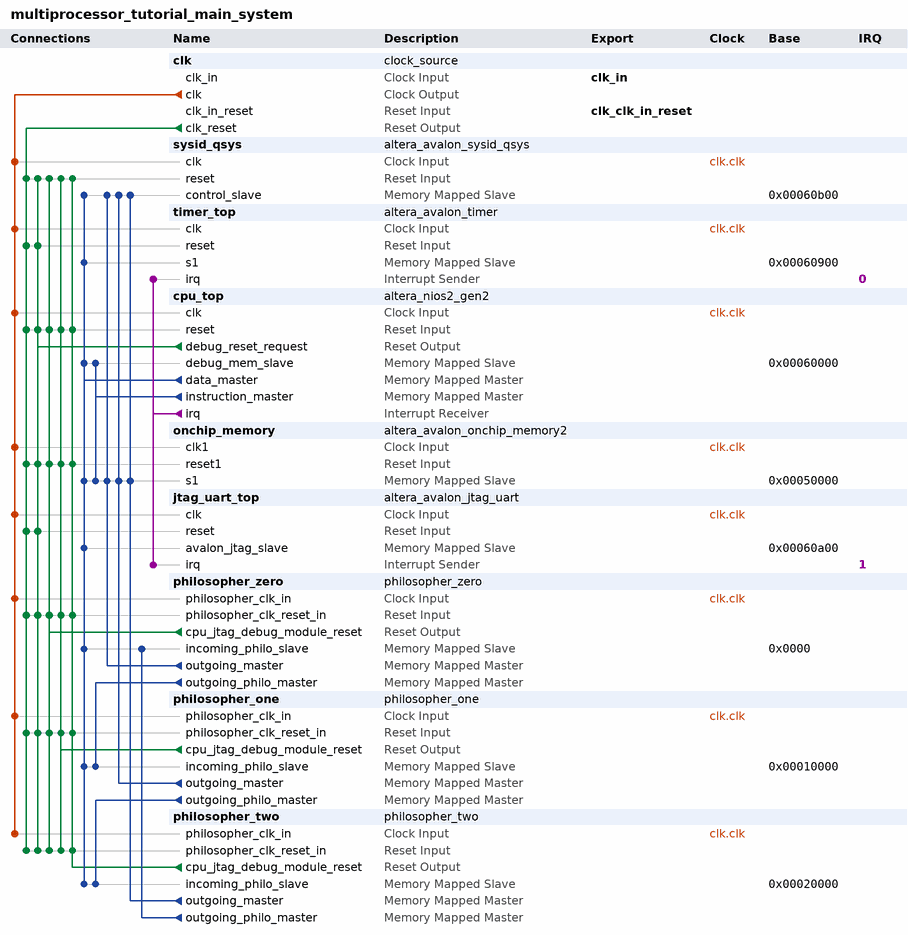
[diagram p0: system contents]
# Platform Designer (Qsys) system multiprocessor_tutorial_main_system, MAX 10 10M50DAF484C6GES
# Parameters at their usual value, and those the tool derives, are not listed.
package require -exact qsys 20.1
create_system multiprocessor_tutorial_main_system
set_project_property DEVICE_FAMILY {MAX 10}
set_project_property DEVICE 10M50DAF484C6GES

add_instance clk clock_source 20.1
set_instance_parameter_value clk clockFrequency 50000000

add_instance sysid_qsys altera_avalon_sysid_qsys 20.1
set_instance_parameter_value sysid_qsys id 0

add_instance timer_top altera_avalon_timer 20.1
set_instance_parameter_value timer_top period 10
set_instance_parameter_value timer_top periodUnits MSEC

add_instance cpu_top altera_nios2_gen2 20.1
set_instance_parameter_value cpu_top cpuID 5
set_instance_parameter_value cpu_top dcache_size 32768
set_instance_parameter_value cpu_top exceptionOffset 24608
set_instance_parameter_value cpu_top exceptionSlave onchip_memory.s1
set_instance_parameter_value cpu_top icache_size 32768
set_instance_parameter_value cpu_top impl Tiny
set_instance_parameter_value cpu_top mmu_autoAssignTlbPtrSz false
set_instance_parameter_value cpu_top resetOffset 24576
set_instance_parameter_value cpu_top resetSlave onchip_memory.s1
set_instance_parameter_value cpu_top setting_activateTrace true

add_instance onchip_memory altera_avalon_onchip_memory2 20.1
set_instance_parameter_value onchip_memory dataWidth 32
set_instance_parameter_value onchip_memory dualPort false
set_instance_parameter_value onchip_memory initMemContent true
set_instance_parameter_value onchip_memory initializationFileName onchip_memory
set_instance_parameter_value onchip_memory memorySize 32769

add_instance jtag_uart_top altera_avalon_jtag_uart 20.1
set_instance_parameter_value jtag_uart_top simInteractiveOptions INTERACTIVE_ASCII_OUTPUT

add_instance philosopher_zero philosopher_zero 1.0

add_instance philosopher_one philosopher_one 1.0

add_instance philosopher_two philosopher_two 1.0

# connections
add_connection clk.clk cpu_top.clk clock
add_connection clk.clk jtag_uart_top.clk clock
add_connection clk.clk onchip_memory.clk1 clock
add_connection clk.clk philosopher_one.philosopher_clk_in clock
add_connection clk.clk philosopher_two.philosopher_clk_in clock
add_connection clk.clk philosopher_zero.philosopher_clk_in clock
add_connection clk.clk sysid_qsys.clk clock
add_connection clk.clk timer_top.clk clock
add_connection clk.clk_reset cpu_top.reset reset
add_connection clk.clk_reset jtag_uart_top.reset reset
add_connection clk.clk_reset onchip_memory.reset1 reset
add_connection clk.clk_reset philosopher_one.philosopher_clk_reset_in reset
add_connection clk.clk_reset philosopher_two.philosopher_clk_reset_in reset
add_connection clk.clk_reset philosopher_zero.philosopher_clk_reset_in reset
add_connection clk.clk_reset sysid_qsys.reset reset
add_connection clk.clk_reset timer_top.reset reset
add_connection cpu_top.debug_reset_request cpu_top.reset reset
add_connection cpu_top.debug_reset_request jtag_uart_top.reset reset
add_connection cpu_top.debug_reset_request onchip_memory.reset1 reset
add_connection cpu_top.debug_reset_request philosopher_one.philosopher_clk_reset_in reset
add_connection cpu_top.debug_reset_request philosopher_two.philosopher_clk_reset_in reset
add_connection cpu_top.debug_reset_request philosopher_zero.philosopher_clk_reset_in reset
add_connection cpu_top.debug_reset_request sysid_qsys.reset reset
add_connection cpu_top.debug_reset_request timer_top.reset reset
add_connection philosopher_one.cpu_jtag_debug_module_reset cpu_top.reset reset
add_connection philosopher_one.cpu_jtag_debug_module_reset onchip_memory.reset1 reset
add_connection philosopher_one.cpu_jtag_debug_module_reset philosopher_one.philosopher_clk_reset_in reset
add_connection philosopher_one.cpu_jtag_debug_module_reset philosopher_two.philosopher_clk_reset_in reset
add_connection philosopher_one.cpu_jtag_debug_module_reset philosopher_zero.philosopher_clk_reset_in reset
add_connection philosopher_one.cpu_jtag_debug_module_reset sysid_qsys.reset reset
add_connection philosopher_two.cpu_jtag_debug_module_reset cpu_top.reset reset
add_connection philosopher_two.cpu_jtag_debug_module_reset onchip_memory.reset1 reset
add_connection philosopher_two.cpu_jtag_debug_module_reset philosopher_one.philosopher_clk_reset_in reset
add_connection philosopher_two.cpu_jtag_debug_module_reset philosopher_two.philosopher_clk_reset_in reset
add_connection philosopher_two.cpu_jtag_debug_module_reset philosopher_zero.philosopher_clk_reset_in reset
add_connection philosopher_two.cpu_jtag_debug_module_reset sysid_qsys.reset reset
add_connection philosopher_zero.cpu_jtag_debug_module_reset cpu_top.reset reset
add_connection philosopher_zero.cpu_jtag_debug_module_reset onchip_memory.reset1 reset
add_connection philosopher_zero.cpu_jtag_debug_module_reset philosopher_one.philosopher_clk_reset_in reset
add_connection philosopher_zero.cpu_jtag_debug_module_reset philosopher_two.philosopher_clk_reset_in reset
add_connection philosopher_zero.cpu_jtag_debug_module_reset philosopher_zero.philosopher_clk_reset_in reset
add_connection philosopher_zero.cpu_jtag_debug_module_reset sysid_qsys.reset reset
add_connection cpu_top.data_master cpu_top.debug_mem_slave avalon
set_connection_parameter_value cpu_top.data_master/cpu_top.debug_mem_slave baseAddress 0x00060000
add_connection cpu_top.data_master jtag_uart_top.avalon_jtag_slave avalon
set_connection_parameter_value cpu_top.data_master/jtag_uart_top.avalon_jtag_slave baseAddress 0x00060a00
add_connection cpu_top.data_master onchip_memory.s1 avalon
set_connection_parameter_value cpu_top.data_master/onchip_memory.s1 baseAddress 0x00050000
add_connection cpu_top.data_master philosopher_one.incoming_philo_slave avalon
set_connection_parameter_value cpu_top.data_master/philosopher_one.incoming_philo_slave baseAddress 0x00010000
add_connection cpu_top.data_master philosopher_two.incoming_philo_slave avalon
set_connection_parameter_value cpu_top.data_master/philosopher_two.incoming_philo_slave baseAddress 0x00020000
add_connection cpu_top.data_master philosopher_zero.incoming_philo_slave avalon
set_connection_parameter_value cpu_top.data_master/philosopher_zero.incoming_philo_slave baseAddress 0x0000
add_connection cpu_top.data_master sysid_qsys.control_slave avalon
set_connection_parameter_value cpu_top.data_master/sysid_qsys.control_slave baseAddress 0x00060b00
add_connection cpu_top.data_master timer_top.s1 avalon
set_connection_parameter_value cpu_top.data_master/timer_top.s1 baseAddress 0x00060900
add_connection cpu_top.instruction_master cpu_top.debug_mem_slave avalon
set_connection_parameter_value cpu_top.instruction_master/cpu_top.debug_mem_slave baseAddress 0x00060000
add_connection cpu_top.instruction_master onchip_memory.s1 avalon
set_connection_parameter_value cpu_top.instruction_master/onchip_memory.s1 baseAddress 0x00050000
add_connection philosopher_one.outgoing_master onchip_memory.s1 avalon
set_connection_parameter_value philosopher_one.outgoing_master/onchip_memory.s1 baseAddress 0x00050000
add_connection philosopher_one.outgoing_master sysid_qsys.control_slave avalon
set_connection_parameter_value philosopher_one.outgoing_master/sysid_qsys.control_slave baseAddress 0x00060b00
add_connection philosopher_one.outgoing_philo_master philosopher_two.incoming_philo_slave avalon
set_connection_parameter_value philosopher_one.outgoing_philo_master/philosopher_two.incoming_philo_slave baseAddress 0x00020000
add_connection philosopher_two.outgoing_master onchip_memory.s1 avalon
set_connection_parameter_value philosopher_two.outgoing_master/onchip_memory.s1 baseAddress 0x00050000
add_connection philosopher_two.outgoing_master sysid_qsys.control_slave avalon
set_connection_parameter_value philosopher_two.outgoing_master/sysid_qsys.control_slave baseAddress 0x00060b00
add_connection philosopher_two.outgoing_philo_master philosopher_zero.incoming_philo_slave avalon
set_connection_parameter_value philosopher_two.outgoing_philo_master/philosopher_zero.incoming_philo_slave baseAddress 0x0000
add_connection philosopher_zero.outgoing_master onchip_memory.s1 avalon
set_connection_parameter_value philosopher_zero.outgoing_master/onchip_memory.s1 baseAddress 0x00050000
add_connection philosopher_zero.outgoing_master sysid_qsys.control_slave avalon
set_connection_parameter_value philosopher_zero.outgoing_master/sysid_qsys.control_slave baseAddress 0x00060b00
add_connection philosopher_zero.outgoing_philo_master philosopher_one.incoming_philo_slave avalon
set_connection_parameter_value philosopher_zero.outgoing_philo_master/philosopher_one.incoming_philo_slave baseAddress 0x00010000
add_connection cpu_top.irq jtag_uart_top.irq interrupt
set_connection_parameter_value cpu_top.irq/jtag_uart_top.irq irqNumber 1
add_connection cpu_top.irq timer_top.irq interrupt
set_connection_parameter_value cpu_top.irq/timer_top.irq irqNumber 0

# exported interfaces
add_interface clk_clk_in_reset reset sink
set_interface_property clk_clk_in_reset EXPORT_OF clk.clk_in_reset
add_interface clk_in clock sink
set_interface_property clk_in EXPORT_OF clk.clk_in

set_interconnect_requirement {$system} qsys_mm.clockCrossingAdapter HANDSHAKE
set_interconnect_requirement {$system} qsys_mm.maxAdditionalLatency 0

save_system multiprocessor_tutorial_main_system.qsys
